# EAGLE schematic VideoBoy1.12 (EAGLE 8.2.2)
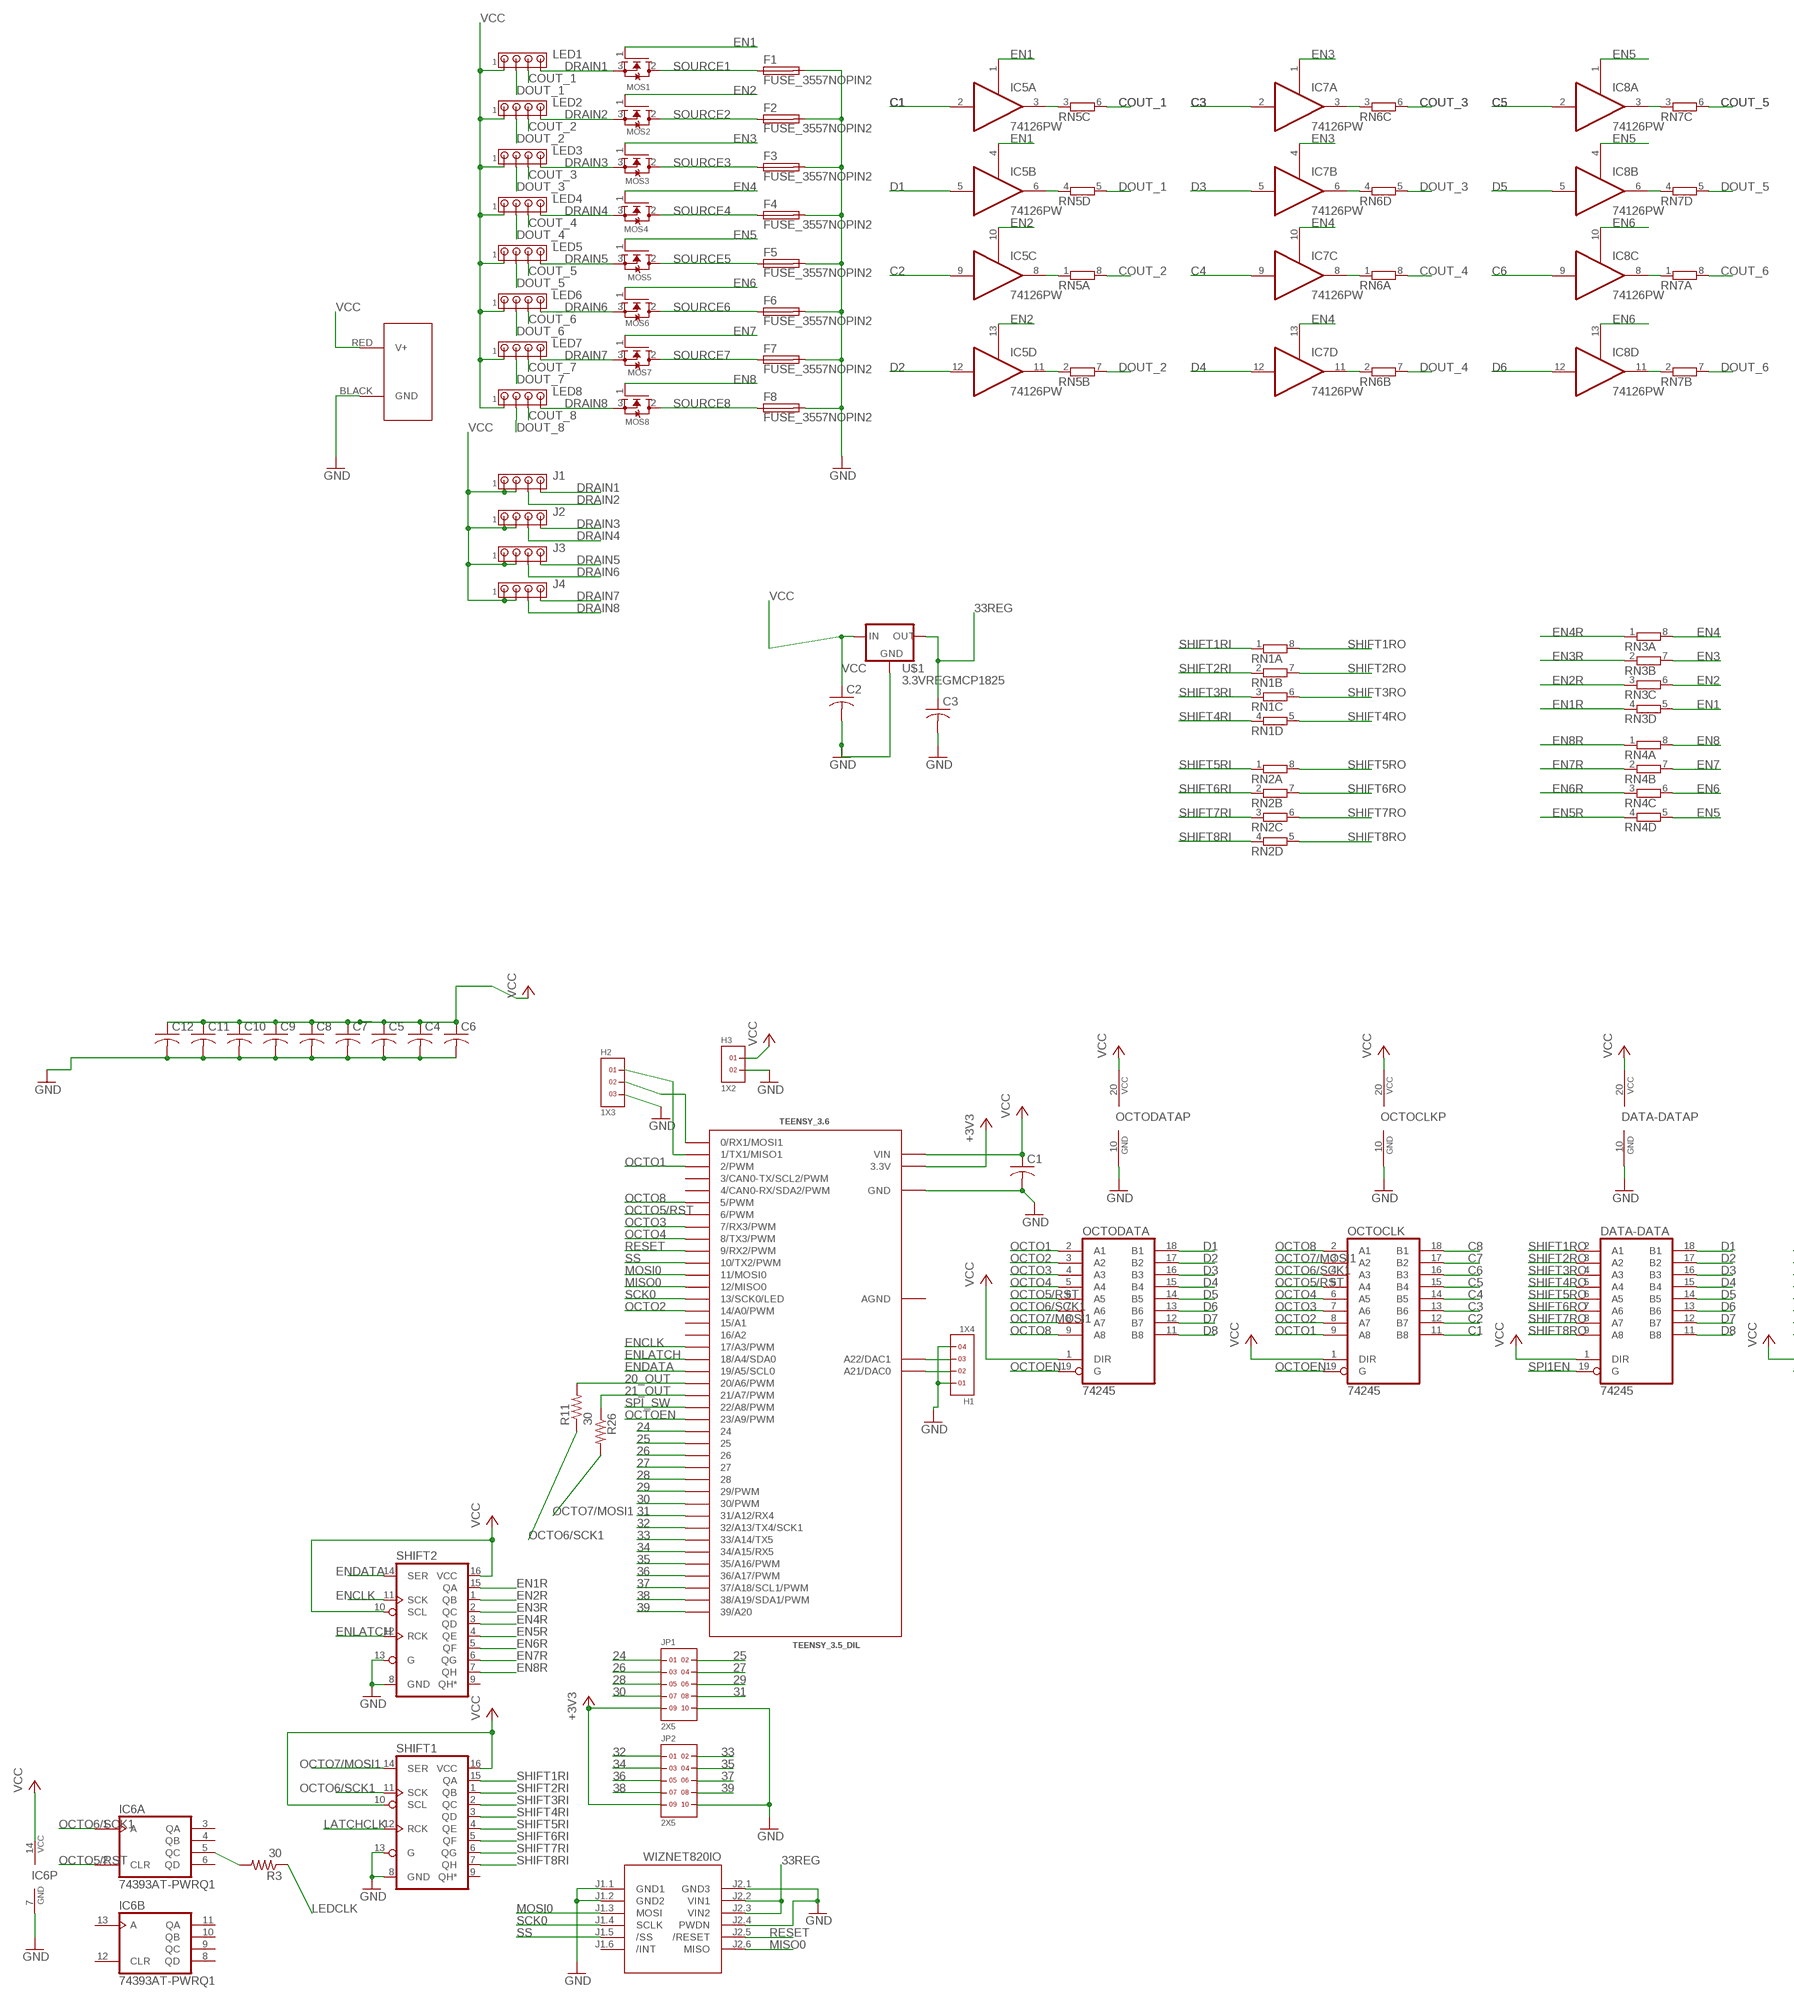
[diagram p0: schematic, sheet 1, part 1 of 2]
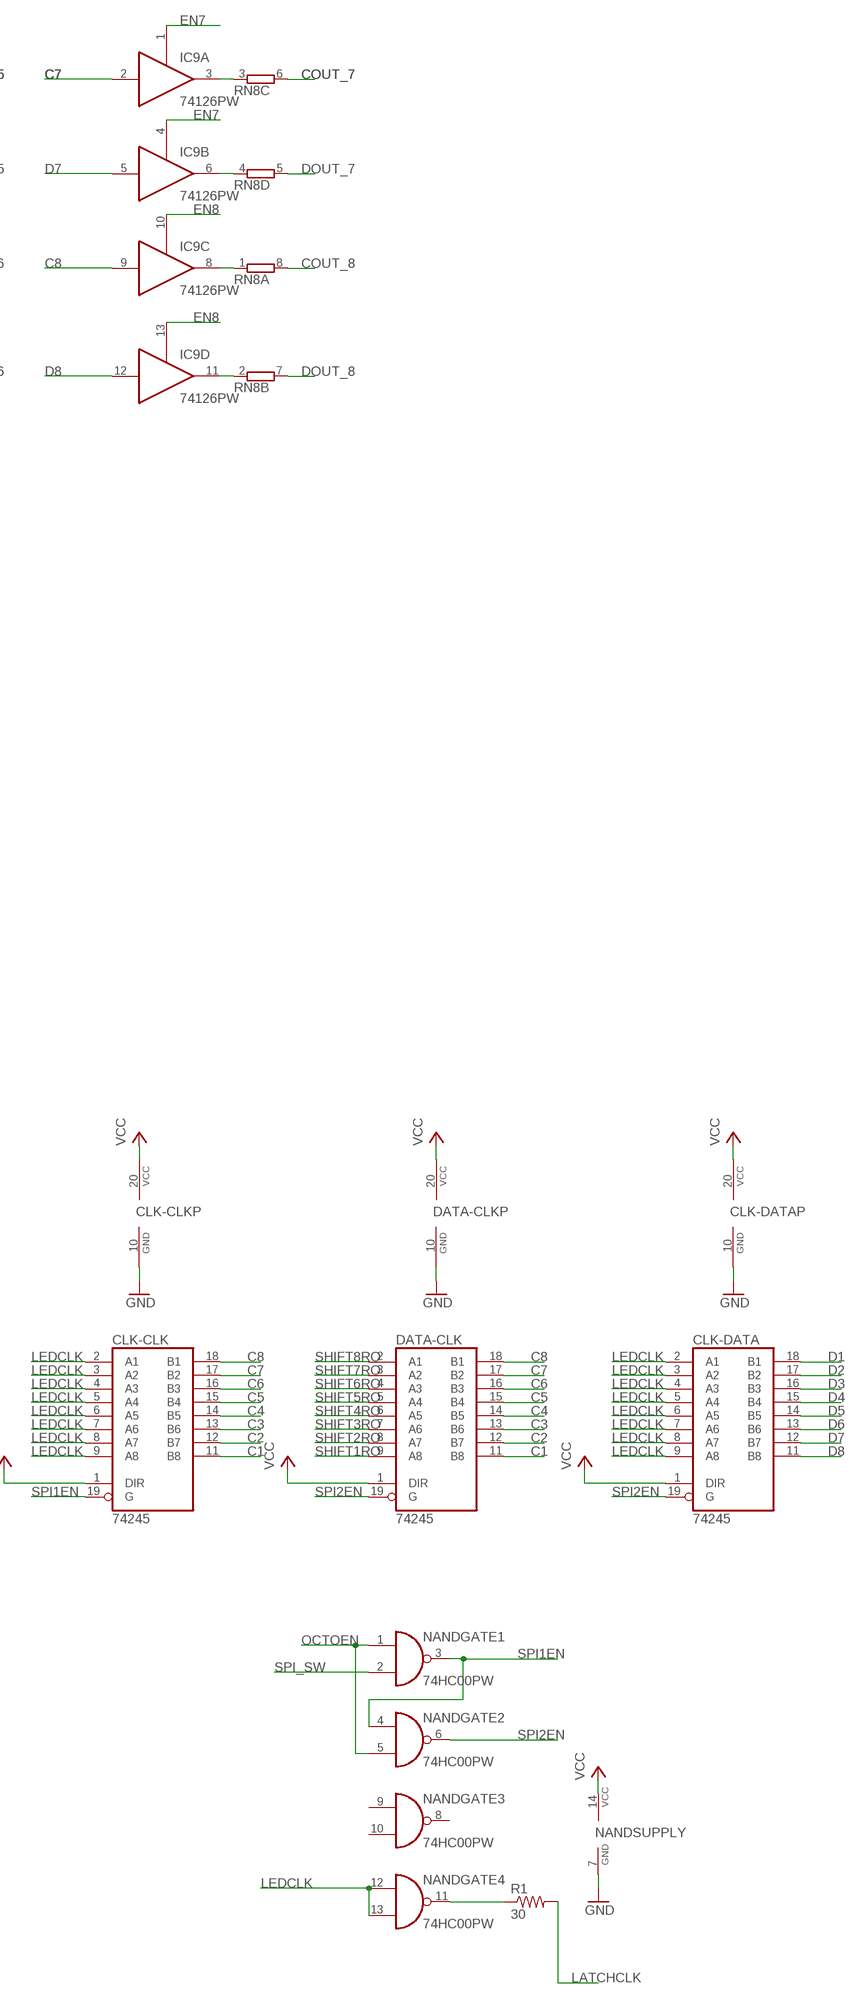
[diagram p1: schematic, sheet 1, part 2 of 2]

## Parts
C1  C-USC0603K  [C0603K]
C2  C-USC0603K  [C0603K]
C3  C-USC0603K  [C0603K]
C4  C-USC0603K  [C0603K]
C5  C-USC0603K  [C0603K]
C6  C-USC0603K  [C0603K]
C7  C-USC0603K  [C0603K]
C8  C-USC0603K  [C0603K]
C9  C-USC0603K  [C0603K]
C10  C-USC0603K  [C0603K]
C11  C-USC0603K  [C0603K]
C12  C-USC0603K  [C0603K]
CLK-CLK  74245  [TSSOP20]
CLK-DATA  74245  [TSSOP20]
DATA-CLK  74245  [TSSOP20]
DATA-DATA  74245  [TSSOP20]
F1  FUSE_3557NOPIN2  [3557]
F2  FUSE_3557NOPIN2  [3557]
F3  FUSE_3557NOPIN2  [3557]
F4  FUSE_3557NOPIN2  [3557]
F5  FUSE_3557NOPIN2  [3557]
F6  FUSE_3557NOPIN2  [3557]
F7  FUSE_3557NOPIN2  [3557]
F8  FUSE_3557NOPIN2  [3557]
H1  1X4  [1X4]
H2  1X3  [1X3]
H3  1X2  [1X2]
IC5  74126PW  [TSSOP14]
IC6  74393AT-PWRQ1  [TSSOP14]
IC7  74126PW  [TSSOP14]
IC8  74126PW  [TSSOP14]
IC9  74126PW  [TSSOP14]
J1  4PIN-JST/TE  [BOARDMOUNT-LED]
J2  4PIN-JST/TE  [BOARDMOUNT-LED]
J3  4PIN-JST/TE  [BOARDMOUNT-LED]
J4  4PIN-JST/TE  [BOARDMOUNT-LED]
J5  POWERPOLE_POWER25A  [POWERPOLE_PAIR_25A]
JP1  2X5  [2X5]
JP2  2X5  [2X5]
LED1  4PIN-JST/TE  [BOARDMOUNT-LED]
LED2  4PIN-JST/TE  [BOARDMOUNT-LED]
LED3  4PIN-JST/TE  [BOARDMOUNT-LED]
LED4  4PIN-JST/TE  [BOARDMOUNT-LED]
LED5  4PIN-JST/TE  [BOARDMOUNT-LED]
LED6  4PIN-JST/TE  [BOARDMOUNT-LED]
LED7  4PIN-JST/TE  [BOARDMOUNT-LED]
LED8  4PIN-JST/TE  [BOARDMOUNT-LED]
MOS1  N-CHANNEL_MOSFET_TO-252  [TO-252]
MOS2  N-CHANNEL_MOSFET_TO-252  [TO-252]
MOS3  N-CHANNEL_MOSFET_TO-252  [TO-252]
MOS4  N-CHANNEL_MOSFET_TO-252  [TO-252]
MOS5  N-CHANNEL_MOSFET_TO-252  [TO-252]
MOS6  N-CHANNEL_MOSFET_TO-252  [TO-252]
MOS7  N-CHANNEL_MOSFET_TO-252  [TO-252]
MOS8  N-CHANNEL_MOSFET_TO-252  [TO-252]
NAND  74HC00PW  [TSSOP14]
OCTOCLK  74245  [TSSOP20]
OCTODATA  74245  [TSSOP20]
R1  30  R-US_R0603  [R0603]
R3  30  R-US_R0603  [R0603]
R11  30  R-US_R0603  [R0603]
R26  R-US_R0603  [R0603]
RN1  4R-N0603-ARV  [0603-ARV]
RN2  4R-N0603-ARV  [0603-ARV]
RN3  4R-N0603-ARV  [0603-ARV]
RN4  4R-N0603-ARV  [0603-ARV]
RN5  4R-N0603-ARV  [0603-ARV]
RN6  4R-N0603-ARV  [0603-ARV]
RN7  4R-N0603-ARV  [0603-ARV]
RN8  4R-N0603-ARV  [0603-ARV]
SHIFT1  74595PWR  [TSSOP16]
SHIFT2  74595PWR  [TSSOP16]
TEENSY_3.6  TEENSY_3.5_DIL  [TEENSY_3.5_DIL]
U$1  3.3VREGMCP1825  [SOT223]
WIZNET820IO  WIZ820IO_DEVICE'DUAL-IN-LINE'  [WIZ820IO]

## Nets
20_OUT: R11.2 TEENSY_3.6.20/A6(20/A6/PWM)
21_OUT: R26.1 TEENSY_3.6.21/A7(21/A7/PWM)
24: JP1.1 TEENSY_3.6.24
25: JP1.2 TEENSY_3.6.25
26: JP1.3 TEENSY_3.6.26
27: JP1.4 TEENSY_3.6.27
28: JP1.5 TEENSY_3.6.28
29: JP1.6 TEENSY_3.6.29(29/PWM)
30: JP1.7 TEENSY_3.6.30(30/PWM)
31: JP1.8 TEENSY_3.6.31/A12(31/A12/RX4)
32: JP2.1 TEENSY_3.6.32/A13(32/A13/TX4/SCK1)
33: JP2.2 TEENSY_3.6.33/A14(33/A14/TX5)
33REG: C3.1 U$1.3(OUT) WIZNET820IO.J2.2(VIN1) WIZNET820IO.J2.3(VIN2)
34: JP2.3 TEENSY_3.6.34/A15(34/A15/RX5)
35: JP2.4 TEENSY_3.6.35/A16(35/A16/PWM)
36: JP2.5 TEENSY_3.6.36/A17(36/A17/PWM)
37: JP2.6 TEENSY_3.6.37/A18(37/A18/SCL1/PWM)
38: JP2.7 TEENSY_3.6.38/A19(38/A19/SDA1/PWM)
39: JP2.8 TEENSY_3.6.39/A20
+3V3: JP1.9 JP2.9 TEENSY_3.6.3.3V TEENSY_3.6.3.3V3(3.3V)
C1: CLK-CLK.11(B8) DATA-CLK.11(B8) IC5.2(A:I) OCTOCLK.11(B8)
C2: CLK-CLK.12(B7) DATA-CLK.12(B7) IC5.9(C:I) OCTOCLK.12(B7)
C3: CLK-CLK.13(B6) DATA-CLK.13(B6) IC7.2(A:I) OCTOCLK.13(B6)
C4: CLK-CLK.14(B5) DATA-CLK.14(B5) IC7.9(C:I) OCTOCLK.14(B5)
C5: CLK-CLK.15(B4) DATA-CLK.15(B4) IC8.2(A:I) OCTOCLK.15(B4)
C6: CLK-CLK.16(B3) DATA-CLK.16(B3) IC8.9(C:I) OCTOCLK.16(B3)
C7: CLK-CLK.17(B2) DATA-CLK.17(B2) IC9.2(A:I) OCTOCLK.17(B2)
C8: CLK-CLK.18(B1) DATA-CLK.18(B1) IC9.9(C:I) OCTOCLK.18(B1)
COUT_1: LED1.3 RN5.6
COUT_2: LED2.3 RN5.8
COUT_3: LED3.3 RN6.6
COUT_4: LED4.3 RN6.8
COUT_5: LED5.3 RN7.6
COUT_6: LED6.3 RN7.8
COUT_7: LED7.3 RN8.6
COUT_8: LED8.3 RN8.8
CROUT9: IC5.3(A:O) RN5.3
CROUT10: IC5.8(C:O) RN5.1
CROUT11: IC7.3(A:O) RN6.3
CROUT12: IC7.8(C:O) RN6.1
CROUT13: IC9.3(A:O) RN8.3
CROUT14: IC8.8(C:O) RN7.1
CROUT15: IC9.8(C:O) RN8.1
CROUT16: IC8.3(A:O) RN7.3
D1: CLK-DATA.18(B1) DATA-DATA.18(B1) IC5.5(B:I) OCTODATA.18(B1)
D2: CLK-DATA.17(B2) DATA-DATA.17(B2) IC5.12(D:I) OCTODATA.17(B2)
D3: CLK-DATA.16(B3) DATA-DATA.16(B3) IC7.5(B:I) OCTODATA.16(B3)
D4: CLK-DATA.15(B4) DATA-DATA.15(B4) IC7.12(D:I) OCTODATA.15(B4)
D5: CLK-DATA.14(B5) DATA-DATA.14(B5) IC8.5(B:I) OCTODATA.14(B5)
D6: CLK-DATA.13(B6) DATA-DATA.13(B6) IC8.12(D:I) OCTODATA.13(B6)
D7: CLK-DATA.12(B7) DATA-DATA.12(B7) IC9.5(B:I) OCTODATA.12(B7)
D8: CLK-DATA.11(B8) DATA-DATA.11(B8) IC9.12(D:I) OCTODATA.11(B8)
DAC0: H1.2 TEENSY_3.6.A21(A21/DAC0)
DAC1: H1.3 TEENSY_3.6.A22(A22/DAC1)
DOUT_1: LED1.2 RN5.5
DOUT_2: LED2.2 RN5.7
DOUT_3: LED3.2 RN6.5
DOUT_4: LED4.2 RN6.7
DOUT_5: LED5.2 RN7.5
DOUT_6: LED6.2 RN7.7
DOUT_7: LED7.2 RN8.5
DOUT_8: LED8.2 RN8.7
DRAIN1: J1.4 LED1.4 MOS1.3(S)
DRAIN2: J1.3 LED2.4 MOS2.3(S)
DRAIN3: J2.4 LED3.4 MOS3.3(S)
DRAIN4: J2.3 LED4.4 MOS4.3(S)
DRAIN5: J3.4 LED5.4 MOS5.3(S)
DRAIN6: J3.3 LED6.4 MOS6.3(S)
DRAIN7: J4.4 LED7.4 MOS7.3(S)
DRAIN8: J4.3 LED8.4 MOS8.3(S)
DROUT9: IC5.6(B:O) RN5.4
DROUT10: IC5.11(D:O) RN5.2
DROUT11: IC7.6(B:O) RN6.4
DROUT12: IC7.11(D:O) RN6.2
DROUT13: IC9.6(B:O) RN8.4
DROUT14: IC8.11(D:O) RN7.2
DROUT15: IC9.11(D:O) RN8.2
DROUT16: IC8.6(B:O) RN7.4
EN1: IC5.1(A:OE) IC5.4(B:OE) MOS1.1(G) RN3.5
EN1R: RN3.4 SHIFT2.15(QA)
EN2: IC5.10(C:OE) IC5.13(D:OE) MOS2.1(G) RN3.6
EN2R: RN3.3 SHIFT2.1(QB)
EN3: IC7.1(A:OE) IC7.4(B:OE) MOS3.1(G) RN3.7
EN3R: RN3.2 SHIFT2.2(QC)
EN4: IC7.10(C:OE) IC7.13(D:OE) MOS4.1(G) RN3.8
EN4R: RN3.1 SHIFT2.3(QD)
EN5: IC8.1(A:OE) IC8.4(B:OE) MOS5.1(G) RN4.5
EN5R: RN4.4 SHIFT2.4(QE)
EN6: IC8.10(C:OE) IC8.13(D:OE) MOS6.1(G) RN4.6
EN6R: RN4.3 SHIFT2.5(QF)
EN7: IC9.1(A:OE) IC9.4(B:OE) MOS7.1(G) RN4.7
EN7R: RN4.2 SHIFT2.6(QG)
EN8: IC9.10(C:OE) IC9.13(D:OE) MOS8.1(G) RN4.8
EN8R: RN4.1 SHIFT2.7(QH)
ENCLK: SHIFT2.11(SCK) TEENSY_3.6.17/A3(17/A3/PWM)
ENDATA: SHIFT2.14(SER) TEENSY_3.6.19/A5(19/A5/SCL0)
ENLATCH: SHIFT2.12(RCK) TEENSY_3.6.18/A4(18/A4/SDA0)
GND: C1.2 C2.2 C3.2 C4.2 C5.2 C6.2 C7.2 C8.2 C9.2 C10.2 C11.2 C12.2 CLK-CLK.10(GND) CLK-DATA.10(GND) DATA-CLK.10(GND) DATA-DATA.10(GND) F1.3 F1.4 F2.3 F2.4 F3.3 F3.4 F4.3 F4.4 F5.3 F5.4 F6.3 F6.4 F7.3 F7.4 F8.3 F8.4 H1.1 H1.4 H2.3 H3.2 IC6.7(P:GND) J5.BLACK(GND) JP1.10 JP2.10 NAND.7(SUPPLY:GND) OCTOCLK.10(GND) OCTODATA.10(GND) SHIFT1.8(GND) SHIFT1.13(G) SHIFT2.8(GND) SHIFT2.13(G) TEENSY_3.6.GND TEENSY_3.6.GND1(GND) U$1.2(GND) U$1.4(GND) WIZNET820IO.J1.1(GND1) WIZNET820IO.J1.2(GND2) WIZNET820IO.J2.1(GND3) WIZNET820IO.J2.4(PWDN)
LATCHCLK: R1.2 SHIFT1.12(RCK)
LATCHCLKR: NAND.11(GATE4:O) R1.1
LEDCLK: CLK-CLK.2(A1) CLK-CLK.3(A2) CLK-CLK.4(A3) CLK-CLK.5(A4) CLK-CLK.6(A5) CLK-CLK.7(A6) CLK-CLK.8(A7) CLK-CLK.9(A8) CLK-DATA.2(A1) CLK-DATA.3(A2) CLK-DATA.4(A3) CLK-DATA.5(A4) CLK-DATA.6(A5) CLK-DATA.7(A6) CLK-DATA.8(A7) CLK-DATA.9(A8) NAND.12(GATE4:I0) NAND.13(GATE4:I1) R3.1
LEDCLKR: IC6.5(A:QC) R3.2
MISO0: TEENSY_3.6.12(12/MISO0) WIZNET820IO.J2.6(MISO)
MOSI0: TEENSY_3.6.11(11/MOSI0) WIZNET820IO.J1.3(MOSI)
N$8: H2.2 TEENSY_3.6.0(0/RX1/MOSI1)
N$9: H2.1 TEENSY_3.6.1(1/TX1/MISO1)
OCTO1: OCTOCLK.9(A8) OCTODATA.2(A1) TEENSY_3.6.2(2/PWM)
OCTO2: OCTOCLK.8(A7) OCTODATA.3(A2) TEENSY_3.6.14/A0(14/A0/PWM)
OCTO3: OCTOCLK.7(A6) OCTODATA.4(A3) TEENSY_3.6.7(7/RX3/PWM)
OCTO4: OCTOCLK.6(A5) OCTODATA.5(A4) TEENSY_3.6.8(8/TX3/PWM)
OCTO5/RST: IC6.2(A:CLR) OCTOCLK.5(A4) OCTODATA.6(A5) TEENSY_3.6.6(6/PWM)
OCTO6/SCK1: IC6.1(A:A) OCTOCLK.4(A3) OCTODATA.7(A6) R11.1 SHIFT1.11(SCK)
OCTO7/MOSI1: OCTOCLK.3(A2) OCTODATA.8(A7) R26.2 SHIFT1.14(SER)
OCTO8: OCTOCLK.2(A1) OCTODATA.9(A8) TEENSY_3.6.5(5/PWM)
OCTOEN: NAND.1(GATE1:I0) NAND.5(GATE2:I1) OCTOCLK.19(G) OCTODATA.19(G) TEENSY_3.6.23/A9(23/A9/PWM)
RESET: TEENSY_3.6.9(9/RX2/PWM) WIZNET820IO.J2.5(/RESET)
SCK0: TEENSY_3.6.13(13/SCK0/LED) WIZNET820IO.J1.4(SCLK)
SHIFT1RI: RN1.1 SHIFT1.15(QA)
SHIFT1RO: DATA-CLK.9(A8) DATA-DATA.2(A1) RN1.8
SHIFT2RI: RN1.2 SHIFT1.1(QB)
SHIFT2RO: DATA-CLK.8(A7) DATA-DATA.3(A2) RN1.7
SHIFT3RI: RN1.3 SHIFT1.2(QC)
SHIFT3RO: DATA-CLK.7(A6) DATA-DATA.4(A3) RN1.6
SHIFT4RI: RN1.4 SHIFT1.3(QD)
SHIFT4RO: DATA-CLK.6(A5) DATA-DATA.5(A4) RN1.5
SHIFT5RI: RN2.1 SHIFT1.4(QE)
SHIFT5RO: DATA-CLK.5(A4) DATA-DATA.6(A5) RN2.8
SHIFT6RI: RN2.2 SHIFT1.5(QF)
SHIFT6RO: DATA-CLK.4(A3) DATA-DATA.7(A6) RN2.7
SHIFT7RI: RN2.3 SHIFT1.6(QG)
SHIFT7RO: DATA-CLK.3(A2) DATA-DATA.8(A7) RN2.6
SHIFT8RI: RN2.4 SHIFT1.7(QH)
SHIFT8RO: DATA-CLK.2(A1) DATA-DATA.9(A8) RN2.5
SOURCE1: F1.1 MOS1.2(D)
SOURCE2: F2.1 MOS2.2(D)
SOURCE3: F3.1 MOS3.2(D)
SOURCE4: F4.1 MOS4.2(D)
SOURCE5: F5.1 MOS5.2(D)
SOURCE6: F6.1 MOS6.2(D)
SOURCE7: F7.1 MOS7.2(D)
SOURCE8: F8.1 MOS8.2(D)
SPI1EN: CLK-CLK.19(G) DATA-DATA.19(G) NAND.3(GATE1:O) NAND.4(GATE2:I0)
SPI2EN: CLK-DATA.19(G) DATA-CLK.19(G) NAND.6(GATE2:O)
SPI_SW: NAND.2(GATE1:I1) TEENSY_3.6.22/A8(22/A8/PWM)
SS: TEENSY_3.6.10(10/TX2/PWM) WIZNET820IO.J1.5(/SS)
VCC: C1.1 C2.1 C4.1 C5.1 C6.1 C7.1 C8.1 C9.1 C10.1 C11.1 C12.1 CLK-CLK.1(DIR) CLK-CLK.20(VCC) CLK-DATA.1(DIR) CLK-DATA.20(VCC) DATA-CLK.1(DIR) DATA-CLK.20(VCC) DATA-DATA.1(DIR) DATA-DATA.20(VCC) H3.1 IC6.14(P:VCC) J1.1 J1.2 J2.1 J2.2 J3.1 J3.2 J4.1 J4.2 J5.RED(V+) LED1.1 LED2.1 LED3.1 LED4.1 LED5.1 LED6.1 LED7.1 LED8.1 NAND.14(SUPPLY:VCC) OCTOCLK.1(DIR) OCTOCLK.20(VCC) OCTODATA.1(DIR) OCTODATA.20(VCC) SHIFT1.10(SCL) SHIFT1.16(VCC) SHIFT2.10(SCL) SHIFT2.16(VCC) TEENSY_3.6.VIN U$1.1(IN)
Unconnected: IC6.3(A:QA) IC6.4(A:QB) IC6.6(A:QD) IC6.8(B:QD) IC6.9(B:QC) IC6.10(B:QB) IC6.11(B:QA) IC6.12(B:CLR) IC6.13(B:A) NAND.8(GATE3:O) NAND.9(GATE3:I0) NAND.10(GATE3:I1) SHIFT1.9(QH*) SHIFT2.9(QH*) TEENSY_3.6.3(3/CAN0-TX/SCL2/PWM) TEENSY_3.6.4(4/CAN0-RX/SDA2/PWM) TEENSY_3.6.15/A1 TEENSY_3.6.16/A2 WIZNET820IO.J1.6(/INT)

## Power pins joined to a net without a drawn wire
AGND: TEENSY_3.6.AGND
GND: IC5.7(P:GND) IC7.7(P:GND) IC8.7(P:GND) IC9.7(P:GND)
VCC: IC5.14(P:VCC) IC7.14(P:VCC) IC8.14(P:VCC) IC9.14(P:VCC)

## Library data of the parts
C1-C12 = adafruit:C-US: CAPACITOR, American symbol
CLK-CLK CLK-DATA DATA-CLK DATA-DATA OCTOCLK OCTODATA = My TI Chips:74*245: Octal BUS TRANSCEIVER, 3-state
F1-F8 = My Fuses:FUSE_: 3557 2 in 1 fuse mini auto
H1 = headers(.1in):1X4
H2 = headers(.1in):1X3
H3 = headers(.1in):1X2
IC5 IC7-IC9 = My TI Chips:74*126: Quad bus BUFFER, 3-state
IC6 = My TI Chips:74*393
J1-J4 LED1-LED8 = My Connectors:4PIN-JST/TE: AMP connector
J5 = powerpoles:POWERPOLE_POWER: Anderson Powerpole Power Connector using ameteur radio standard layout
JP1 JP2 = headers(.1in):2X5
MOS1-MOS8 = My Power ICs:N-CHANNEL_MOSFET_
NAND = 74ac-logic:74HC00PW: Quad Nand Gate TSSOP14
R1 R3 R11 R26 = adafruit:R-US_: RESISTOR, American symbol
RN1-RN8 = resistor-dil:4R-N: Array Chip Resistor Source: RS Component / Phycomp; OC_FARNELL: unknown; OC_NEWARK: unknown
SHIFT1 SHIFT2 = My TI Chips:74*595: 8-Bit Shift Register (Serial to Parallel) Datasheet <http://cdn.sparkfun.com/datasheets/BreakoutBoards/MM74HC595.pdf> SparkFun Products SparkFun Shift Register Breakout - 74HC595 <https://www.sparkfun.com/products/10680> (BOB-10680)
TEENSY_3.6 = Teensy_3_and_LC_Series_Boards_v1.4:TEENSY_3.5_DIL: DIL version of the Teensy 3.5
U$1 = My Power ICs:3.3VREG
WIZNET820IO = Wiz820io:WIZ820IO_DEVICE: WIZnet, WIZ820io plug in module incl. W5200 chip and MagJack